# Altium project Artist_V1.PrjPcb
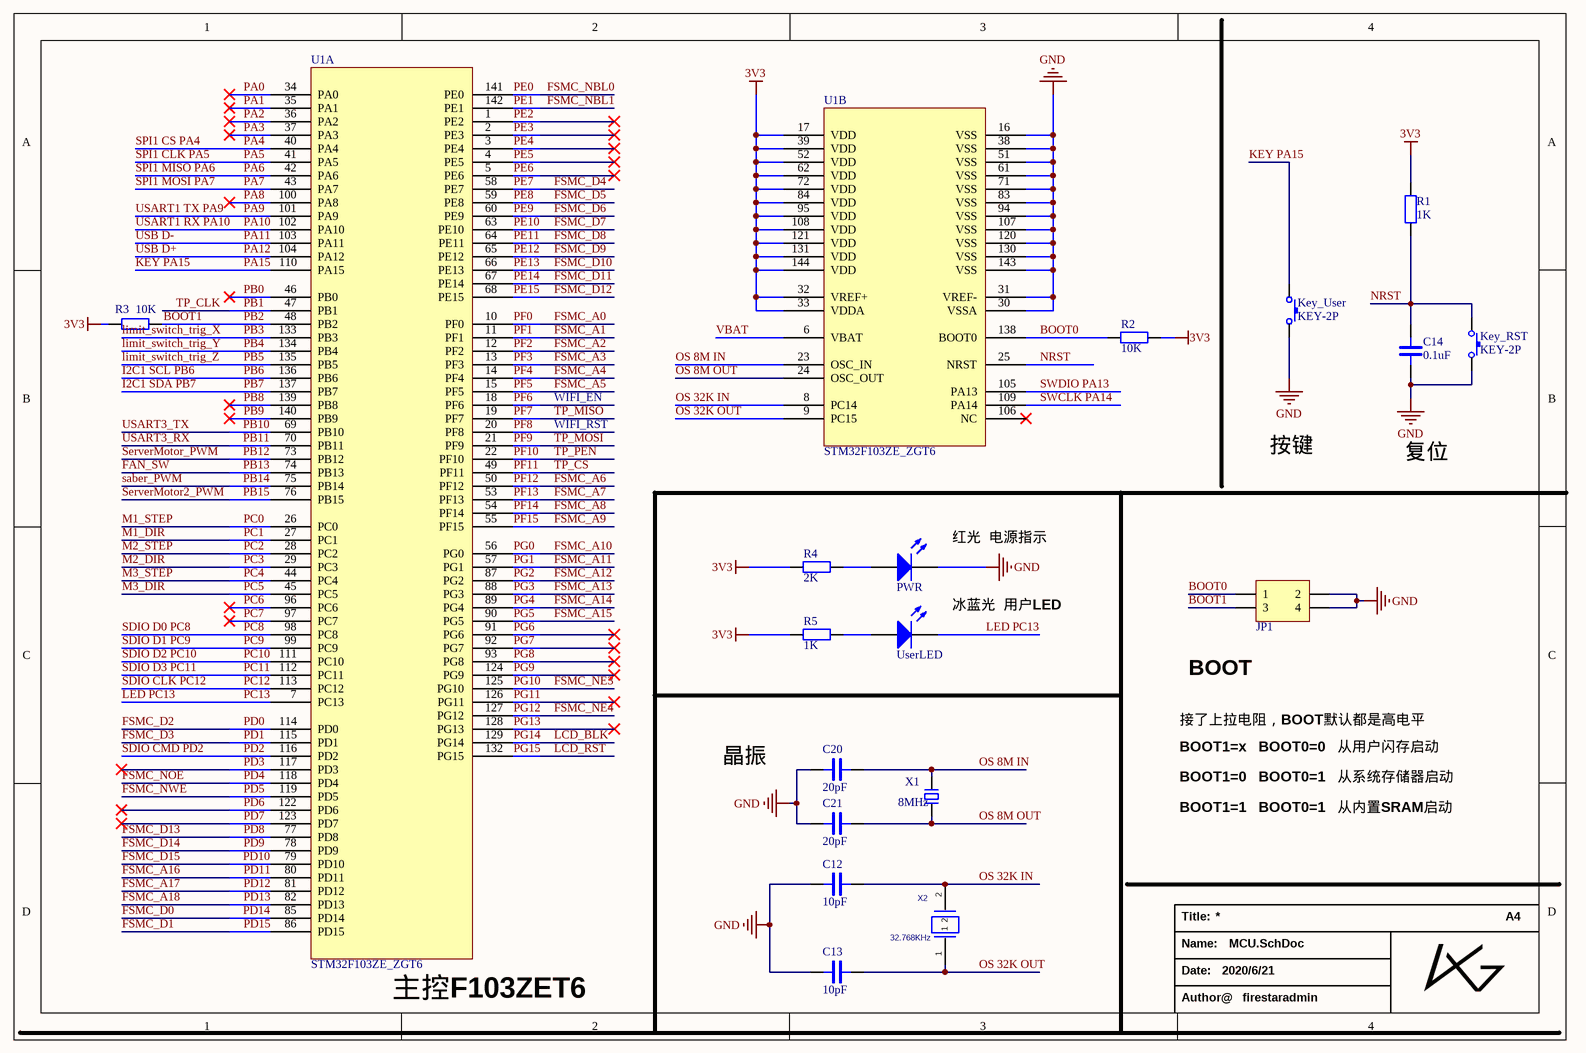
[diagram p0: MCU.SchDoc]
7 sheets, 125 parts. Net scope: global (net labels, ports and power ports of the same name join across sheets).
Board file: ArtistV1.0.PcbDoc
Sheets:
  MCU.SchDoc
  POWER.SchDoc
  Interface.SchDoc
  IC.SchDoc
  MOTORs.SchDoc
  screen.SchDoc
  ESP-12S.SchDoc

## Sheet MCU.SchDoc
size A4; Date: 2020/6/21

### Parts
C12  10pF  [C 0603_M]
C13  10pF  [C 0603_M]
C14  0.1uF  [C 0603_M]
C20  20pF  [C 0603_M]
C21  20pF  [C 0603_M]
JP1  Header2X2  [HDR2.54-LI-2x2P]  (value not drawn)
Key_RST  KEY-2P  [TSW SMD-3*6*2.5]
Key_User  KEY-2P  [TSW SMD-3*6*2.5]
PWR  LED  [LED 0603R]  (value not drawn)
R1  1K  [R 0603_M]
R2  10K  [R 0603_M]
R3  10K  [R 0603_M]
R4  2K  [R 0603_M]
R5  1K  [R 0603_M]
U1  STM32F103ZE_ZGT6  [TQFP144 20x20_M]  (parts A,B of 2)
UserLED  LED  [LED 0603B]  (value not drawn)
X1  8MHz  [OSC 5032-2P]
X2  value 32.768KHz  [OSC 3215-2P]  (hidden comment: XTAL_32.768KHZ_3215)

### Nets
3V3: R1.1 R2.2 R3.2 R4.2 R5.2 U1.17(VDD) U1.32(VREF+) U1.33(VDDA) U1.39(VDD) U1.52(VDD) U1.62(VDD) U1.72(VDD) U1.84(VDD) U1.95(VDD) U1.108(VDD) U1.121(VDD) U1.131(VDD) U1.144(VDD)
GND: C12.2 C13.2 C14.1 C20.2 C21.2 JP1.2 JP1.4 Key_RST.2 Key_User.2 PWR.2(K) U1.16(VSS) U1.30(VSSA) U1.31(VREF-) U1.38(VSS) U1.51(VSS) U1.61(VSS) U1.71(VSS) U1.83(VSS) U1.94(VSS) U1.107(VSS) U1.120(VSS) U1.130(VSS) U1.143(VSS)
BOOT0: JP1.1 R2.1 U1.138(BOOT0)
BOOT1: JP1.3 R3.1 U1.48(PB2)  [also labelled PB2]
FAN_SW: U1.74(PB13)  [also labelled PB13]
FSMC_A0: U1.10(PF0)  [also labelled PF0]
FSMC_A1: U1.11(PF1)  [also labelled PF1]
FSMC_A2: U1.12(PF2)  [also labelled PF2]
FSMC_A3: U1.13(PF3)  [also labelled PF3]
FSMC_A4: U1.14(PF4)  [also labelled PF4]
FSMC_A5: U1.15(PF5)  [also labelled PF5]
FSMC_A6: U1.50(PF12)  [also labelled PF12]
FSMC_A7: U1.53(PF13)  [also labelled PF13]
FSMC_A8: U1.54(PF14)  [also labelled PF14]
FSMC_A9: U1.55(PF15)  [also labelled PF15]
FSMC_A10: U1.56(PG0)  [also labelled PG0]
FSMC_A11: U1.57(PG1)  [also labelled PG1]
FSMC_A12: U1.87(PG2)  [also labelled PG2]
FSMC_A13: U1.88(PG3)  [also labelled PG3]
FSMC_A14: U1.89(PG4)  [also labelled PG4]
FSMC_A15: U1.90(PG5)  [also labelled PG5]
FSMC_A16: U1.80(PD11)  [also labelled PD11]
FSMC_A17: U1.81(PD12)  [also labelled PD12]
FSMC_A18: U1.82(PD13)  [also labelled PD13]
FSMC_D0: U1.85(PD14)  [also labelled PD14]
FSMC_D1: U1.86(PD15)  [also labelled PD15]
FSMC_D2: U1.114(PD0)  [also labelled PD0]
FSMC_D3: U1.115(PD1)  [also labelled PD1]
FSMC_D4: U1.58(PE7)  [also labelled PE7]
FSMC_D5: U1.59(PE8)  [also labelled PE8]
FSMC_D6: U1.60(PE9)  [also labelled PE9]
FSMC_D7: U1.63(PE10)  [also labelled PE10]
FSMC_D8: U1.64(PE11)  [also labelled PE11]
FSMC_D9: U1.65(PE12)  [also labelled PE12]
FSMC_D10: U1.66(PE13)  [also labelled PE13]
FSMC_D11: U1.67(PE14)  [also labelled PE14]
FSMC_D12: U1.68(PE15)  [also labelled PE15]
FSMC_D13: U1.77(PD8)  [also labelled PD8]
FSMC_D14: U1.78(PD9)  [also labelled PD9]
FSMC_D15: U1.79(PD10)  [also labelled PD10]
FSMC_NBL0: U1.141(PE0)  [also labelled PE0]
FSMC_NBL1: U1.142(PE1)  [also labelled PE1]
FSMC_NE3: U1.125(PG10)  [also labelled PG10]
FSMC_NE4: U1.127(PG12)  [also labelled PG12]
FSMC_NOE: U1.118(PD4)  [also labelled PD4]
FSMC_NWE: U1.119(PD5)  [also labelled PD5]
I2C1 SCL PB6: U1.136(PB6)  [also labelled PB6]
I2C1 SDA PB7: U1.137(PB7)  [also labelled PB7]
KEY PA15: Key_User.1 U1.110(PA15)  [also labelled PA15]
LCD_BLK: U1.129(PG14)  [also labelled PG14]
LCD_RST: U1.132(PG15)  [also labelled PG15]
LED PC13: U1.7(PC13) UserLED.2(K)  [also labelled PC13]
limit_switch_trig_X: U1.133(PB3)  [also labelled PB3]
limit_switch_trig_Y: U1.134(PB4)  [also labelled PB4]
limit_switch_trig_Z: U1.135(PB5)  [also labelled PB5]
M1_DIR: U1.27(PC1)  [also labelled PC1]
M1_STEP: U1.26(PC0)  [also labelled PC0]
M2_DIR: U1.29(PC3)  [also labelled PC3]
M2_STEP: U1.28(PC2)  [also labelled PC2]
M3_DIR: U1.45(PC5)  [also labelled PC5]
M3_STEP: U1.44(PC4)  [also labelled PC4]
NRST: C14.2 Key_RST.1 R1.2 U1.25(NRST)
OS 8M IN: C20.1 U1.23(OSC_IN) X1.1
OS 8M OUT: C21.1 U1.24(OSC_OUT) X1.2
OS 32K IN: C12.1 U1.8(PC14) X2.2
OS 32K OUT: C13.1 U1.9(PC15) X2.1
PA0: U1.34(PA0)
PA1: U1.35(PA1)
PA2: U1.36(PA2)
PA3: U1.37(PA3)
PA4: U1.40(PA4)  [also labelled SPI1 CS PA4]
PA5: U1.41(PA5)  [also labelled SPI1 CLK PA5]
PA6: U1.42(PA6)  [also labelled SPI1 MISO PA6]
PA7: U1.43(PA7)  [also labelled SPI1 MOSI PA7]
PA8: U1.100(PA8)
PA9: U1.101(PA9)  [also labelled USART1 TX PA9]
PA10: U1.102(PA10)  [also labelled USART1 RX PA10]
PA11: U1.103(PA11)  [also labelled USB D-]
PA12: U1.104(PA12)  [also labelled USB D+]
PB0: U1.46(PB0)
PB1: U1.47(PB1)  [also labelled TP_CLK]
PB8: U1.139(PB8)
PB9: U1.140(PB9)
PB10: U1.69(PB10)  [also labelled USART3_TX]
PB11: U1.70(PB11)  [also labelled USART3_RX]
PB12: U1.73(PB12)  [also labelled ServerMotor_PWM]
PB14: U1.75(PB14)  [also labelled saber_PWM]
PB15: U1.76(PB15)  [also labelled ServerMotor2_PWM]
PC6: U1.96(PC6)
PC7: U1.97(PC7)
PC8: U1.98(PC8)  [also labelled SDIO D0 PC8]
PC9: U1.99(PC9)  [also labelled SDIO D1 PC9]
PC10: U1.111(PC10)  [also labelled SDIO D2 PC10]
PC11: U1.112(PC11)  [also labelled SDIO D3 PC11]
PC12: U1.113(PC12)  [also labelled SDIO CLK PC12]
PD2: U1.116(PD2)  [also labelled SDIO CMD PD2]
PD3: U1.117(PD3)
PD6: U1.122(PD6)
PD7: U1.123(PD7)
PE2: U1.1(PE2)
PE3: U1.2(PE3)
PE4: U1.3(PE4)
PE5: U1.4(PE5)
PE6: U1.5(PE6)
PF6: U1.18(PF6)
PF7: U1.19(PF7)  [also labelled TP_MISO]
PF8: U1.20(PF8)
PF9: U1.21(PF9)  [also labelled TP_MOSI]
PF10: U1.22(PF10)  [also labelled TP_PEN]
PF11: U1.49(PF11)  [also labelled TP_CS]
PG6: U1.91(PG6)
PG7: U1.92(PG7)
PG8: U1.93(PG8)
PG9: U1.124(PG9)
PG11: U1.126(PG11)
PG13: U1.128(PG13)
SWCLK PA14: U1.109(PA14)
SWDIO PA13: U1.105(PA13)
VBAT: U1.6(VBAT)
NetPWR_1: PWR.1(A) R4.1
NetR5_1: R5.1 UserLED.1(A)

Not connected (* = marked no-connect by the designer): U1 106(NC)*

### Notes on the sheet
- WIFI_RST
- WIFI_EN
- 按键
- 复位
- (near PWR) 红光  电源指示
- 冰蓝光  用户LED
- 接了上拉电阻，BOOT默认都是高电平
- BOOT
- 晶振
- BOOT1=x   BOOT0=0   从用户闪存启动
- BOOT1=0   BOOT0=1   从系统存储器启动
- BOOT1=1   BOOT0=1   从内置SRAM启动
- (near U1) 主控F103ZET6
- Title:
- A4
- Name:
- Date:
- Author@
- firestaradmin

### Library data of the parts
C12-C14 C20 C21 = CAP: Capacitor
JP1 = Header 2X2: 2*2P接插件; 版权归属: 源创客; BOM名称: 2*2P接插件; 学习资源: www.ooocke.com
Key_RST Key_User = KEY-2P: Key
R1-R5 = RES: Resistor
X1 = XTAL-2P: 2脚无源脚晶振; 版权归属: 源创客; BOM名称: 2脚无源脚晶振; 学习资源: www.ooocke.com
X2 = XTAL_32.768KHZ_3215: CRYSTAL; PCB DECAL: 3215

## Sheet POWER.SchDoc
size A4
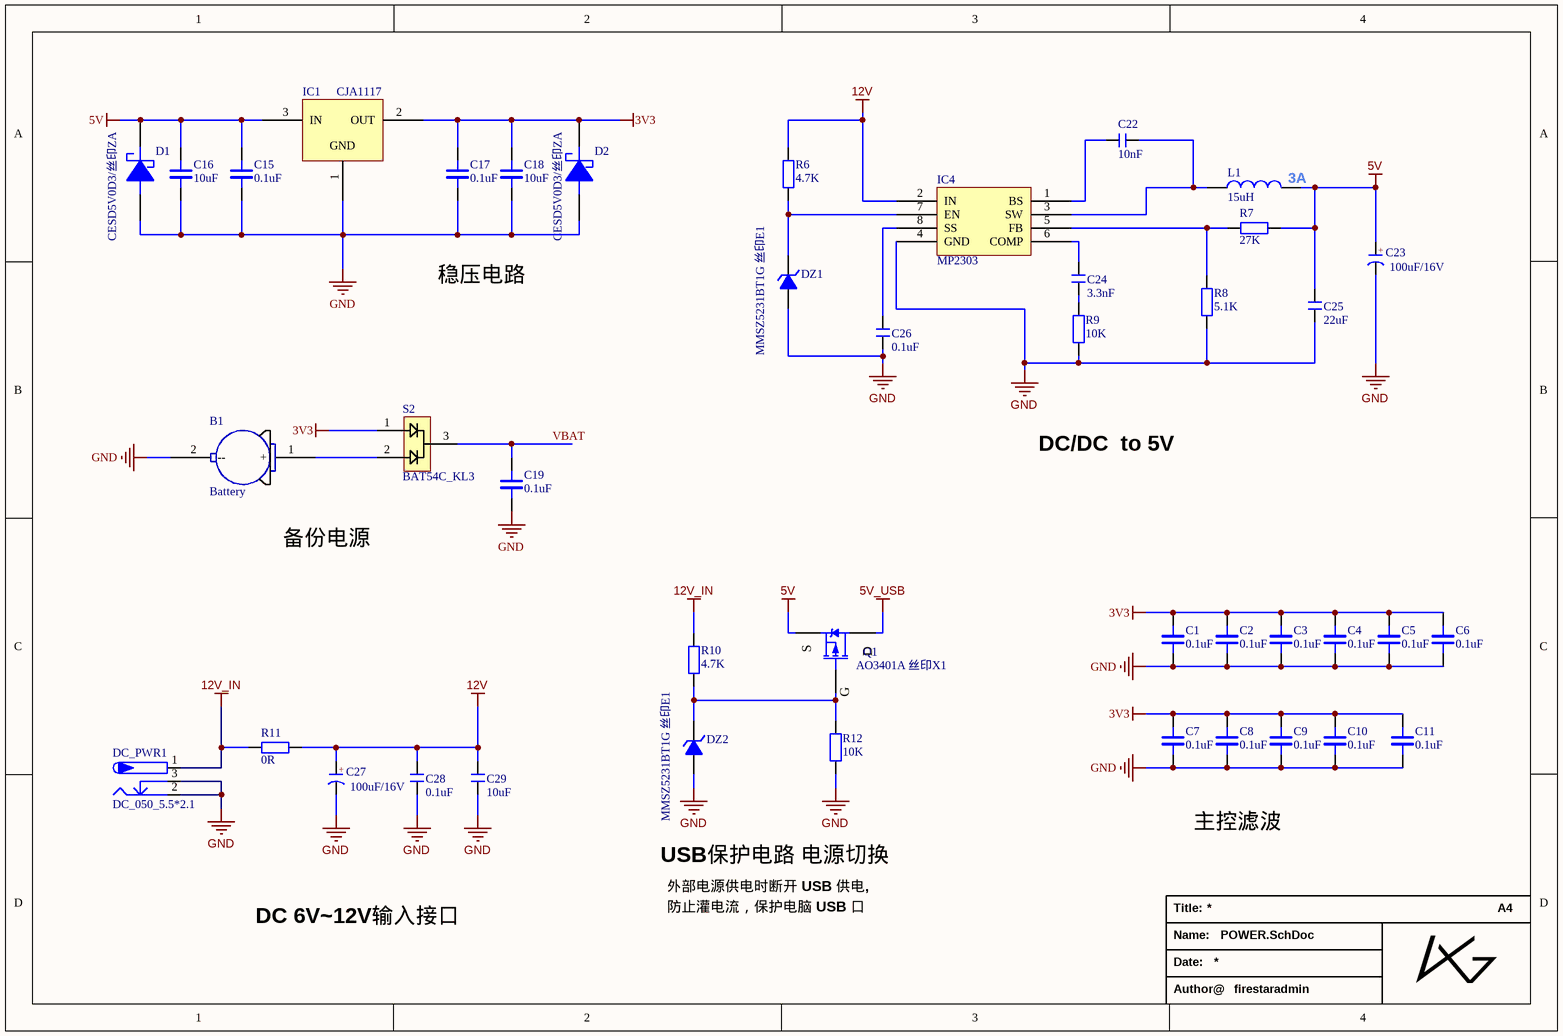
[diagram p1: POWER.SchDoc]

### Parts
B1  Battery  [CR1220_B]
C1  0.1uF  [C 0603_M]
C2  0.1uF  [C 0603_M]
C3  0.1uF  [C 0603_M]
C4  0.1uF  [C 0603_M]
C5  0.1uF  [C 0603_M]
C6  0.1uF  [C 0603_M]
C7  0.1uF  [C 0603_M]
C8  0.1uF  [C 0603_M]
C9  0.1uF  [C 0603_M]
C10  0.1uF  [C 0603_M]
C11  0.1uF  [C 0603_M]
C15  0.1uF  [C 0603_M]
C16  10uF  [C 0603_M]
C17  0.1uF  [C 0603_M]
C18  10uF  [C 0603_M]
C19  0.1uF  [C 0603_M]
C22  10nF  [C 0603_M]
C23  100uF/16V  [CM D(6.3*5.4)]
C24  3.3nF  [C 0603_M]
C25  22uF  [C 0603_M]
C26  0.1uF  [C 0603_M]
C27  100uF/16V  [CM D(6.3*5.4)]
C28  0.1uF  [C 0603_M]
C29  10uF  [C 0603_M]
D1  CESD5V0D3/丝印ZA  [SOD-323]
D2  CESD5V0D3/丝印ZA  [SOD-323]
DC_PWR1  DC_050_5.5*2.1  [DC-050]
DZ1  MMSZ5231BT1G 丝印E1  [SOD-123]
DZ2  MMSZ5231BT1G 丝印E1  [SOD-123]
IC1  CJA1117  [SOT89_M]
IC4  MP2303  [SOP8_M]
L1  15uH  [L-SMD-0630]
Q1  AO3401A 丝印X1  [SOT23-3M]
R6  4.7K  [R 0603_M]
R7  27K  [R 0603_M]
R8  5.1K  [R 0603_M]
R9  10K  [R 0603_M]
R10  4.7K  [R 0603_M]
R11  0R  [R 0603_M]
R12  10K  [R 0603_M]
S2  BAT54C_KL3  [SOT23-3M]

### Nets
3V3: C1.2 C2.2 C3.2 C4.2 C5.2 C6.2 C7.2 C8.2 C9.2 C10.2 C11.2 C17.1 C18.1 D2.2(-) IC1.2(OUT) S2.1
5V: C15.1 C16.1 C23.1(A) C25.2 D1.2(-) IC1.3(IN) L1.2 Q1.2(S) R7.1
5V_USB: Q1.3(D)
12V: C27.1(A) C28.2 C29.2 IC4.2(IN) R6.2 R11.2
12V_IN: DC_PWR1.1 R10.2 R11.1
GND: B1.2(--) C1.1 C2.1 C3.1 C4.1 C5.1 C6.1 C7.1 C8.1 C9.1 C10.1 C11.1 C15.2 C16.2 C17.2 C18.2 C19.2 C23.2(K) C25.1 C26.1 C27.2(K) C28.1 C29.1 D1.1(+) D2.1(+) DC_PWR1.2 DC_PWR1.3 DZ1.1(A) DZ2.1(A) IC1.1(GND) IC4.4(GND) R8.1 R9.1 R12.1
VBAT: C19.1 S2.3
NetB1_1: B1.1(+) S2.2
NetC22_1: C22.1 IC4.3(SW) L1.1
NetC22_2: C22.2 IC4.1(BS)
NetC24_1: C24.1 R9.2
NetC24_2: C24.2 IC4.6(COMP)
NetC26_2: C26.2 IC4.8(SS)
NetDZ1_2: DZ1.2(K) IC4.7(EN) R6.1
NetDZ2_2: DZ2.2(K) Q1.1(G) R10.1 R12.2
NetIC4_5: IC4.5(FB) R7.2 R8.2

### Notes on the sheet
- (near L1) 3A
- 稳压电路
- DC/DC  to 5V
- 备份电源
- 主控滤波
- DC 6V~12V输入接口
- USB保护电路 电源切换
- 外部电源供电时断开 USB 供电,
- 防止灌电流，保护电脑 USB 口
- Title:
- A4
- Name:
- Date:
- Author@
- firestaradmin
- (in symbol C-CM) +

### Library data of the parts
C1-C11 C15-C19 = CAP: Capacitor
C22 C24-C26 C28 C29 = C: 无极性贴片电容; 版权归属: 源创客; BOM名称: 无极性贴片电容; 学习资源: www.ooocke.com
C23 C27 = C-CM: 贴片电解电容; 版权归属: 源创客; BOM名称: 贴片电解电容; 学习资源: www.ooocke.com
D1 D2 = TVS
DC_PWR1 = P-DC: 低压电源接口; BOM名称: DC电源接口; 版权归属: 源创客; 学习资源: www.ooocke.com
DZ1 DZ2 = 1N4625: 5.1V/0.5W稳压管; 版权归属: 源创客; BOM名称: 5.1V/0.5W稳压管; 学习资源: www.ooocke.com
L1 = L: 小功率贴片电感; 版权归属: 源创客; BOM名称: 小功率贴片电感; 学习资源: www.ooocke.com
Q1 = SI2301: P沟道场效应管; 版权归属: 源创客; BOM名称: P沟道场效应管; 学习资源: www.ooocke.com
R6-R12 = R: 贴片电阻; 版权归属: 源创客; BOM名称: 贴片电阻; 学习资源: www.ooocke.com

## Sheet Interface.SchDoc
size A4
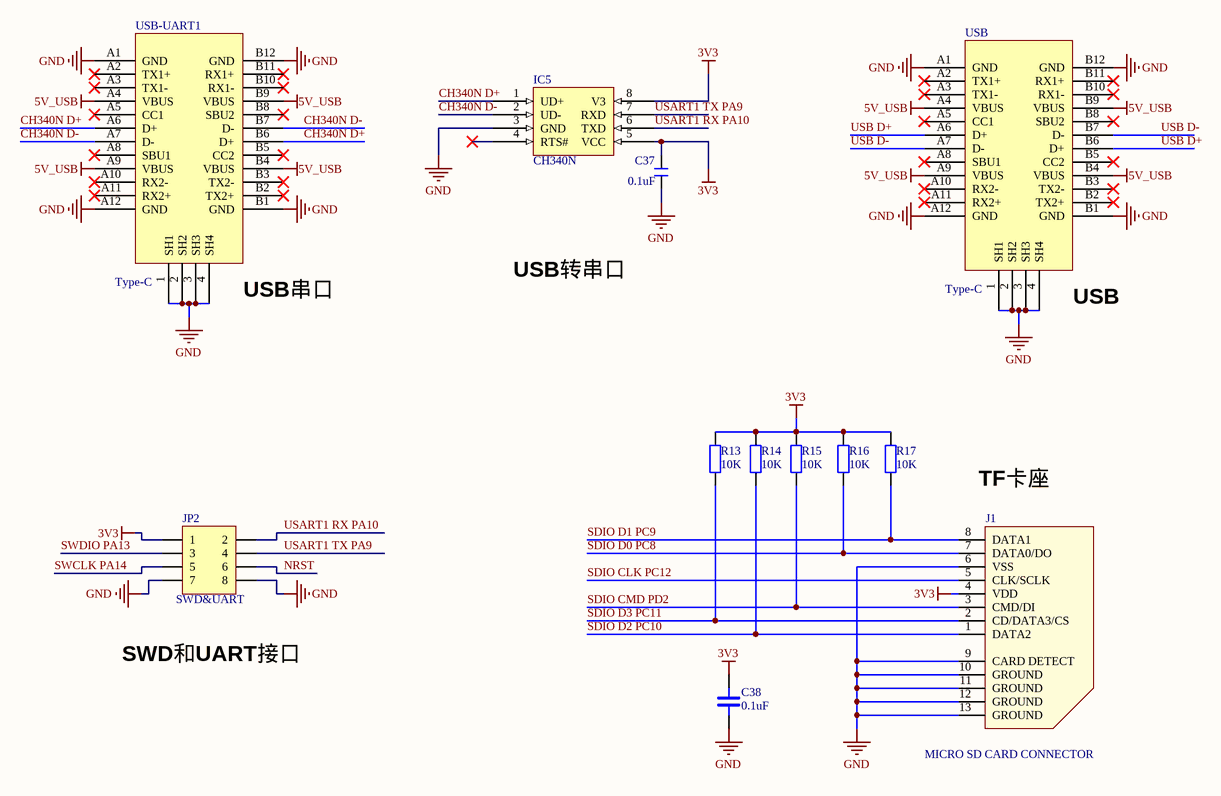
[diagram p2: Interface.SchDoc]

### Parts
C37  0.1uF  [C 0603_M]
C38  0.1uF  [C 0603_M]
IC5  CH340N  [SOP8_M]
J1  MICRO SD CARD CONNECTOR  [Micro SD]
JP2  SWD&UART  [HDR2.54-LI-2x4P]
R13  10K  [R 0603_M]
R14  10K  [R 0603_M]
R15  10K  [R 0603_M]
R16  10K  [R 0603_M]
R17  10K  [R 0603_M]
USB  Type-C  [Type-C]
USB-UART1  Type-C  [Type-C]

### Nets
3V3: C37.2 C38.1 IC5.5(VCC) IC5.8(V3) J1.4(VDD) JP2.1 R13.1 R14.1 R15.1 R16.1 R17.1
5V_USB: USB.A4(VBUS) USB.A9(VBUS) USB.B4(VBUS) USB.B9(VBUS) USB-UART1.A4(VBUS) USB-UART1.A9(VBUS) USB-UART1.B4(VBUS) USB-UART1.B9(VBUS)
GND: C37.1 C38.2 IC5.3(GND) J1.6(VSS) J1.9(CARD_DETECT) J1.10(GROUND) J1.11(GROUND) J1.12(GROUND) J1.13(GROUND) JP2.7 JP2.8 USB.1(SH1) USB.2(SH2) USB.3(SH3) USB.4(SH4) USB.A1(GND) USB.A12(GND) USB.B1(GND) USB.B12(GND) USB-UART1.1(SH1) USB-UART1.2(SH2) USB-UART1.3(SH3) USB-UART1.4(SH4) USB-UART1.A1(GND) USB-UART1.A12(GND) USB-UART1.B1(GND) USB-UART1.B12(GND)
CH340N D+: IC5.1(UD+) USB-UART1.A6(D+) USB-UART1.B6(D+)
CH340N D-: IC5.2(UD-) USB-UART1.A7(D-) USB-UART1.B7(D-)
NRST: JP2.6
SDIO CLK PC12: J1.5(CLK/SCLK)  [project net PC12]
SDIO CMD PD2: J1.3(CMD/DI) R15.2  [project net PD2]
SDIO D0 PC8: J1.7(DATA0/DO) R16.2  [project net PC8]
SDIO D1 PC9: J1.8(DATA1) R17.2  [project net PC9]
SDIO D2 PC10: J1.1(DATA2) R14.2  [project net PC10]
SDIO D3 PC11: J1.2(CD/DATA3/CS) R13.2  [project net PC11]
SWCLK PA14: JP2.5
SWDIO PA13: JP2.3
USART1 RX PA10: IC5.6(TXD) JP2.2  [project net PA10]
USART1 TX PA9: IC5.7(RXD) JP2.4  [project net PA9]
USB D+: USB.A6(D+) USB.B6(D+)  [project net PA12]
USB D-: USB.A7(D-) USB.B7(D-)  [project net PA11]

Not connected (* = marked no-connect by the designer): IC5 4(RTS#)*; USB A2(TX1+)* A3(TX1-)* A5(CC1)* A8(SBU1)* A10(RX2-)* A11(RX2+)* B2(TX2+)* B3(TX2-)* B5(CC2)* B8(SBU2)* B10(RX1-)* B11(RX1+)*; USB-UART1 A2(TX1+)* A3(TX1-)* A5(CC1)* A8(SBU1)* A10(RX2-)* A11(RX2+)* B2(TX2+)* B3(TX2-)* B5(CC2)* B8(SBU2)* B10(RX1-)* B11(RX1+)*

### Notes on the sheet
- (near USB-UART1) USB串口
- USB转串口
- (near USB) USB
- (near J1) TF卡座
- SWD和UART接口
- Title:
- A4
- Name:
- Date:
- Author@
- firestaradmin

### Library data of the parts
C37 = C: 无极性贴片电容; 版权归属: 源创客; BOM名称: 无极性贴片电容; 学习资源: www.ooocke.com
C38 = CAP: Capacitor
IC5 = CH340N: USB 转串口芯片 CH330/CH340N
JP2 = Header 4X2: 4*2P接插件; 版权归属: 源创客; BOM名称: 4*2P接插件; 学习资源: www.ooocke.com
R13-R17 = RES: Resistor

## Sheet IC.SchDoc
size A4
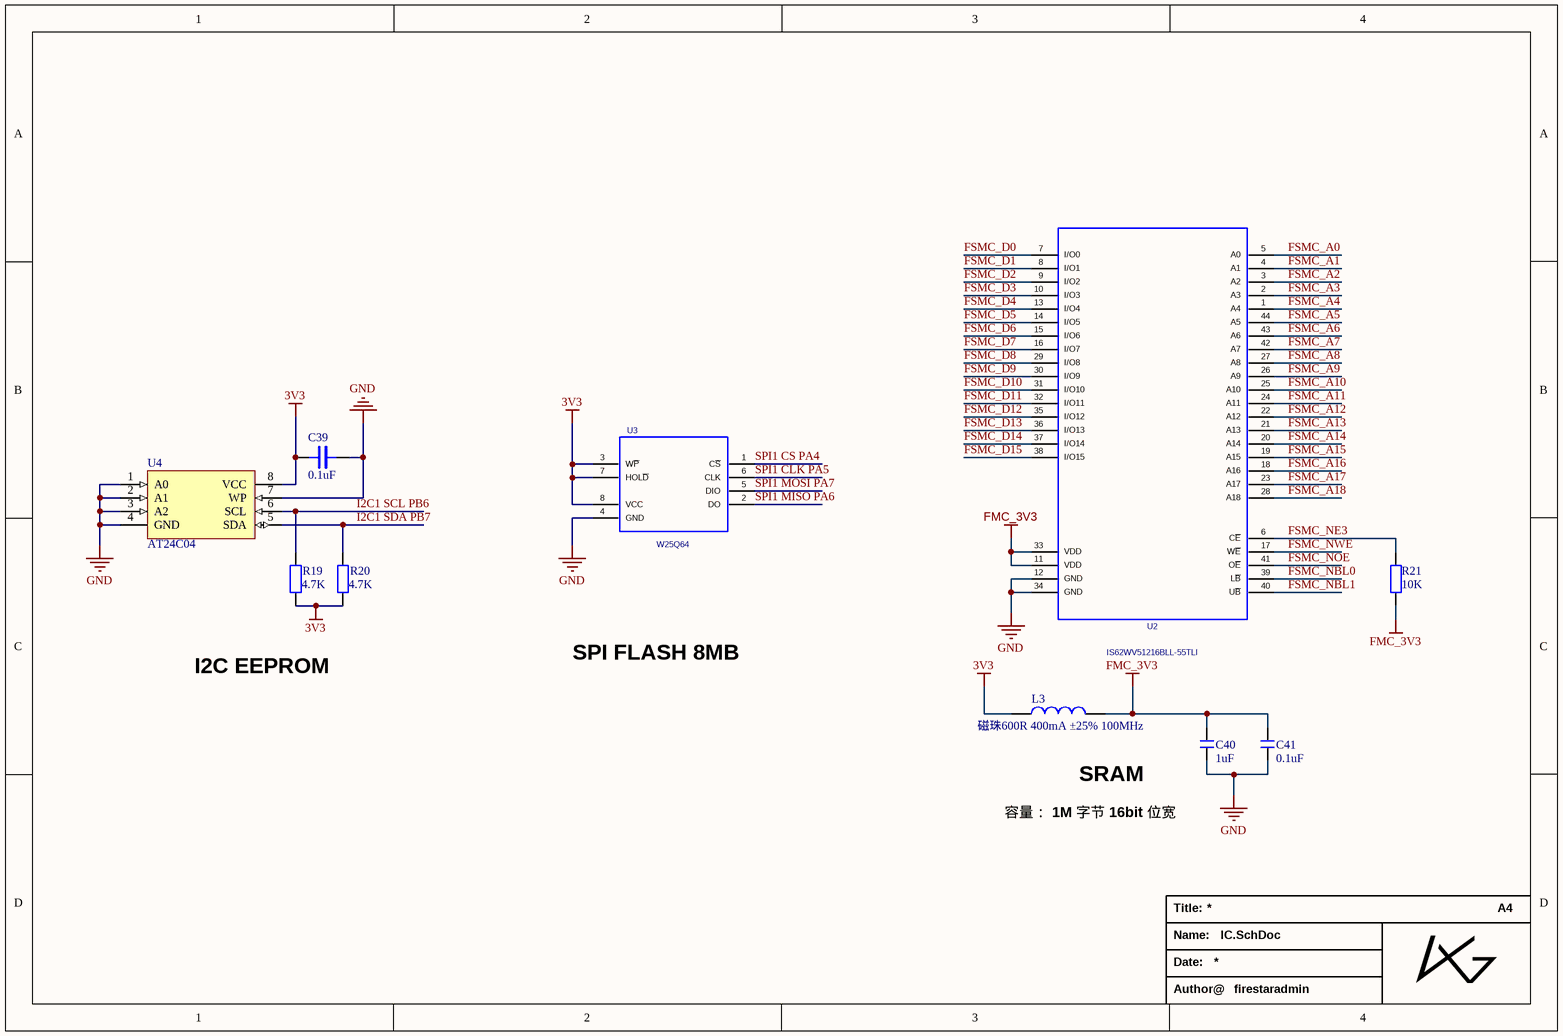
[diagram p3: IC.SchDoc]

### Parts
C39  0.1uF  [C 0603_M]
C40  1uF  [C 0603_M]
C41  0.1uF  [C 0603_M]
L3  磁珠600R 400mA ±25% 100MHz  [L 0603]
R19  4.7K  [R 0603_M]
R20  4.7K  [R 0603_M]
R21  10K  [R 0603_M]
U2  IS62WV51216BLL-55TLI  [TSOP44-0.8MM]
U3  W25Q64  [SOP8W_M]
U4  AT24C04  [SOP8_M]

### Nets
3V3: C39.1 L3.1 R19.2 R20.2 U3.3(W~{P}) U3.7(HOL~{D}) U3.8(VCC) U4.8(VCC)
FMC_3V3: C40.2 C41.2 L3.2 R21.2 U2.11(VDD) U2.33(VDD)
GND: C39.2 C40.1 C41.1 U2.12(GND) U2.34(GND) U3.4(GND) U4.1(A0) U4.2(A1) U4.3(A2) U4.4(GND) U4.7(WP)
FSMC_A0: U2.5(A0)
FSMC_A1: U2.4(A1)
FSMC_A2: U2.3(A2)
FSMC_A3: U2.2(A3)
FSMC_A4: U2.1(A4)
FSMC_A5: U2.44(A5)
FSMC_A6: U2.43(A6)
FSMC_A7: U2.42(A7)
FSMC_A8: U2.27(A8)
FSMC_A9: U2.26(A9)
FSMC_A10: U2.25(A10)
FSMC_A11: U2.24(A11)
FSMC_A12: U2.22(A12)
FSMC_A13: U2.21(A13)
FSMC_A14: U2.20(A14)
FSMC_A15: U2.19(A15)
FSMC_A16: U2.18(A16)
FSMC_A17: U2.23(A17)
FSMC_A18: U2.28(A18)
FSMC_D0: U2.7(I/O0)
FSMC_D1: U2.8(I/O1)
FSMC_D2: U2.9(I/O2)
FSMC_D3: U2.10(I/O3)
FSMC_D4: U2.13(I/O4)
FSMC_D5: U2.14(I/O5)
FSMC_D6: U2.15(I/O6)
FSMC_D7: U2.16(I/O7)
FSMC_D8: U2.29(I/O8)
FSMC_D9: U2.30(I/O9)
FSMC_D10: U2.31(I/O10)
FSMC_D11: U2.32(I/O11)
FSMC_D12: U2.35(I/O12)
FSMC_D13: U2.36(I/O13)
FSMC_D14: U2.37(I/O14)
FSMC_D15: U2.38(I/O15)
FSMC_NBL0: U2.39(L~{B})
FSMC_NBL1: U2.40(U~{B})
FSMC_NE3: R21.1 U2.6(C~{E})
FSMC_NOE: U2.41(O~{E})
FSMC_NWE: U2.17(W~{E})
I2C1 SCL PB6: R19.1 U4.6(SCL)
I2C1 SDA PB7: R20.1 U4.5(SDA)
SPI1 CLK PA5: U3.6(CLK)  [project net PA5]
SPI1 CS PA4: U3.1(C~{S})  [project net PA4]
SPI1 MISO PA6: U3.2(DO)  [project net PA6]
SPI1 MOSI PA7: U3.5(DIO)  [project net PA7]

### Notes on the sheet
- I2C EEPROM
- SPI FLASH 8MB
- (near L3) SRAM
- 容量： 1M 字节 16bit 位宽
- Title:
- A4
- Name:
- Date:
- Author@
- firestaradmin

### Library data of the parts
C39 = CAP: Capacitor
C40 C41 = C: 无极性贴片电容; 版权归属: 源创客; BOM名称: 无极性贴片电容; 学习资源: www.ooocke.com
L3 = L: 小功率贴片电感; 版权归属: 源创客; BOM名称: 小功率贴片电感; 学习资源: www.ooocke.com
R19-R21 = RES: Resistor
U2 = IS62WV51216BLL-55TLI: TSOP-II,2.5V - 3.6V, 512K x 16,55ns; Manufacturer #1 PN: IS62WV51216BLL-55TI; Manufacturer #1: ISSI; Value: IS62WV51216BLL-55TI; Tolerance: 55ns; PCB DECAL: TSOP44-0.8MM
U3 = W25Q64: PCB DECAL: SO8WB
U4 = AT24Cxx: EEPROM

## Sheet MOTORs.SchDoc
size A4
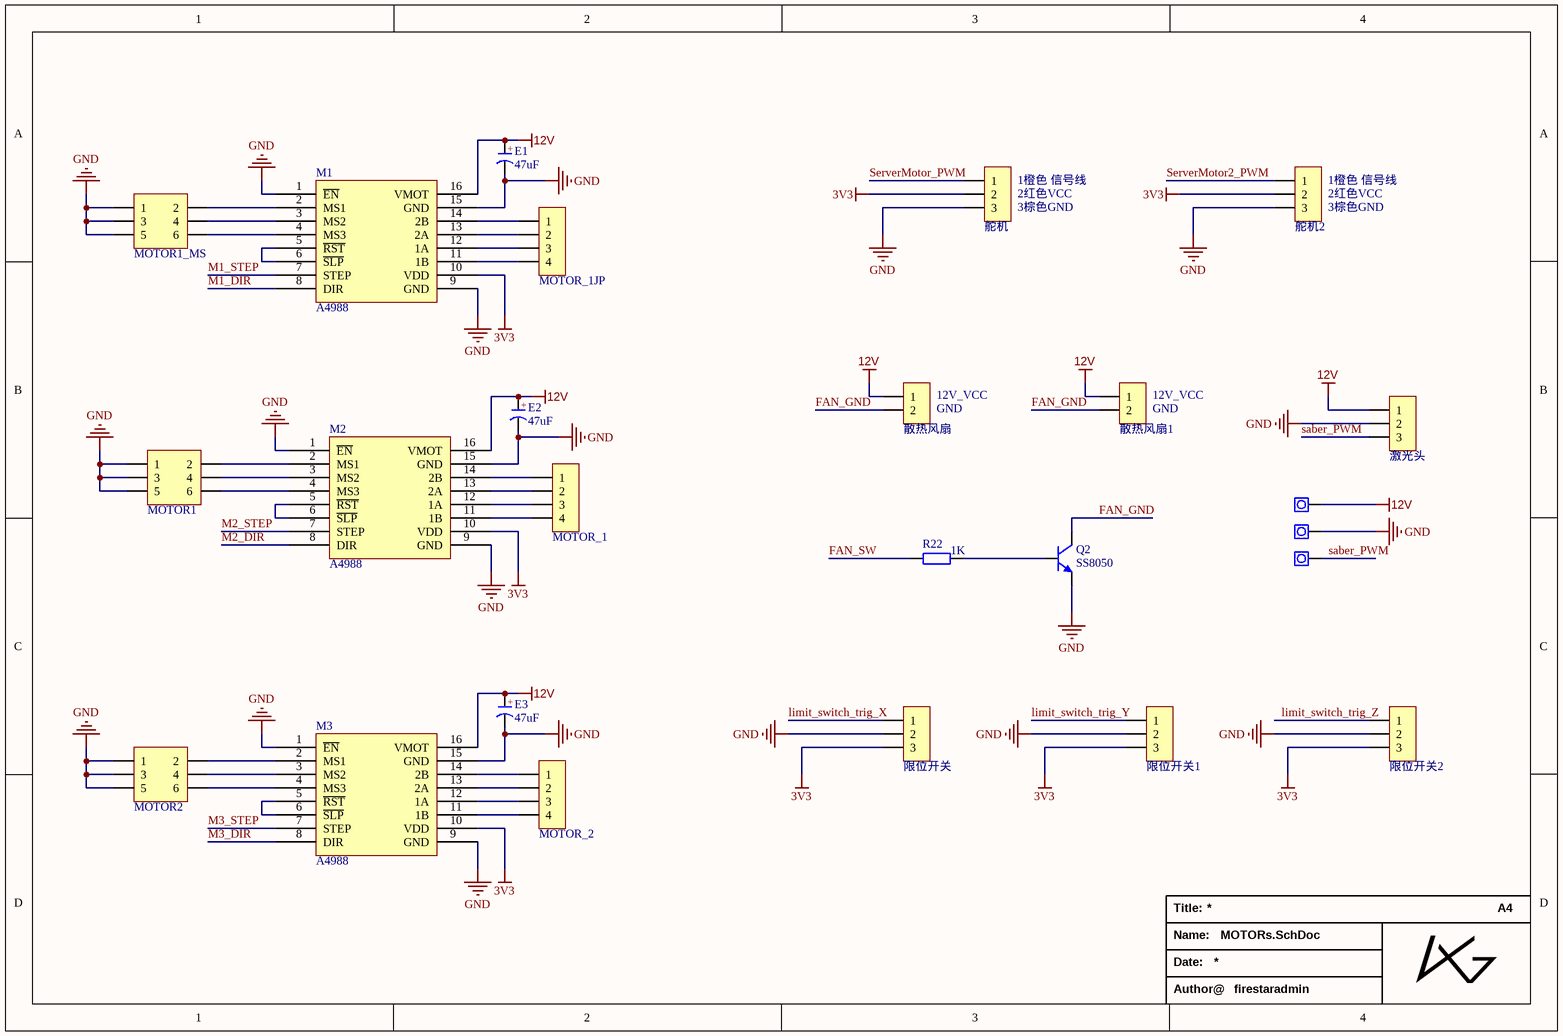
[diagram p4: MOTORs.SchDoc]

### Parts
E1  47uF  [CM D(6.3*5.4)]
E2  47uF  [CM D(6.3*5.4)]
E3  47uF  [CM D(6.3*5.4)]
M1  A4988  [DRV8825]
M2  A4988  [DRV8825]
M3  A4988  [DRV8825]
MOTOR1  Header3X2  [HDR2.54-LI-2x3P]  (value not drawn)
MOTOR1_MS  Header3X2  [HDR2.54-LI-2x3P]  (value not drawn)
MOTOR2  Header3X2  [HDR2.54-LI-2x3P]  (value not drawn)
MOTOR_1  HDR-1X4  [HDR2.54-LI-4P]  (value not drawn)
MOTOR_1JP  HDR-1X4  [HDR2.54-LI-4P]  (value not drawn)
MOTOR_2  HDR-1X4  [HDR2.54-LI-4P]  (value not drawn)
PAD  焊盘2mm*3mm  [PAD-2mm*3mm]  (value not drawn)
PAD1  焊盘2mm*3mm  [PAD-2mm*3mm]  (value not drawn)
PAD2  焊盘2mm*3mm  [PAD-2mm*3mm]  (value not drawn)
Q2  SS8050  [SOT23-3M]
R22  1K  [R 0603_M]
散热风扇  HDR-1X2  [XH2.54-LI-2P]  (value not drawn)
散热风扇1  HDR-1X2  [XH2.54-LI-2P]  (value not drawn)
激光头  HDR-1X3  [HDR2.54-LI-3P]  (value not drawn)
舵机  HDR-1X3  [HDR2.54-LI-3P]  (value not drawn)
舵机2  HDR-1X3  [HDR2.54-LI-3P]  (value not drawn)
限位开关  HDR-1X3  [HDR2.54-LI-3P]  (value not drawn)
限位开关1  HDR-1X3  [HDR2.54-LI-3P]  (value not drawn)
限位开关2  HDR-1X3  [HDR2.54-LI-3P]  (value not drawn)

### Nets
3V3: M1.10(VDD) M2.10(VDD) M3.10(VDD) 舵机.2 舵机2.2 限位开关.3 限位开关1.3 限位开关2.3
12V: E1.1(A) E2.1(A) E3.1(A) M1.16(VMOT) M2.16(VMOT) M3.16(VMOT) PAD.1 散热风扇.1 散热风扇1.1 激光头.1
GND: E1.2(K) E2.2(K) E3.2(K) M1.1(~{EN}) M1.9(GND) M1.15(GND) M2.1(~{EN}) M2.9(GND) M2.15(GND) M3.1(~{EN}) M3.9(GND) M3.15(GND) MOTOR1.1 MOTOR1.3 MOTOR1.5 MOTOR1_MS.1 MOTOR1_MS.3 MOTOR1_MS.5 MOTOR2.1 MOTOR2.3 MOTOR2.5 PAD1.1 Q2.2(E) 激光头.2 舵机.3 舵机2.3 限位开关.2 限位开关1.2 限位开关2.2
FAN_GND: Q2.3(C) 散热风扇.2 散热风扇1.2
FAN_SW: R22.1
limit_switch_trig_X: 限位开关.1
limit_switch_trig_Y: 限位开关1.1
limit_switch_trig_Z: 限位开关2.1
M1_DIR: M1.8(DIR)
M1_STEP: M1.7(STEP)
M2_DIR: M2.8(DIR)
M2_STEP: M2.7(STEP)
M3_DIR: M3.8(DIR)
M3_STEP: M3.7(STEP)
saber_PWM: PAD2.1 激光头.3  [project net PB14]
ServerMotor2_PWM: 舵机2.1  [project net PB15]
ServerMotor_PWM: 舵机.1  [project net PB12]
NetM1_2: M1.2(MS1) MOTOR1_MS.2
NetM1_3: M1.3(MS2) MOTOR1_MS.4
NetM1_4: M1.4(MS3) MOTOR1_MS.6
NetM1_5: M1.5(~{RST}) M1.6(~{SLP})
NetM1_11: M1.11(1B) MOTOR_1JP.4
NetM1_12: M1.12(1A) MOTOR_1JP.3
NetM1_13: M1.13(2A) MOTOR_1JP.2
NetM1_14: M1.14(2B) MOTOR_1JP.1
NetM2_2: M2.2(MS1) MOTOR1.2
NetM2_3: M2.3(MS2) MOTOR1.4
NetM2_4: M2.4(MS3) MOTOR1.6
NetM2_5: M2.5(~{RST}) M2.6(~{SLP})
NetM2_11: M2.11(1B) MOTOR_1.4
NetM2_12: M2.12(1A) MOTOR_1.3
NetM2_13: M2.13(2A) MOTOR_1.2
NetM2_14: M2.14(2B) MOTOR_1.1
NetM3_2: M3.2(MS1) MOTOR2.2
NetM3_3: M3.3(MS2) MOTOR2.4
NetM3_4: M3.4(MS3) MOTOR2.6
NetM3_5: M3.5(~{RST}) M3.6(~{SLP})
NetM3_11: M3.11(1B) MOTOR_2.4
NetM3_12: M3.12(1A) MOTOR_2.3
NetM3_13: M3.13(2A) MOTOR_2.2
NetM3_14: M3.14(2B) MOTOR_2.1
NetQ2_1: Q2.1(B) R22.2

### Notes on the sheet
- (near 舵机) 1橙色 信号线
- (near 舵机) 2红色VCC
- (near 舵机) 3棕色GND
- (near 舵机2) 1橙色 信号线
- (near 舵机2) 2红色VCC
- (near 舵机2) 3棕色GND
- (near 散热风扇) 12V_VCC
- (near 散热风扇) GND
- (near 散热风扇1) 12V_VCC
- (near 散热风扇1) GND
- Title:
- A4
- Name:
- Date:
- Author@
- firestaradmin
- (in symbol C-CM) +

### Library data of the parts
E1-E3 = C-CM: 贴片电解电容; 版权归属: 源创客; BOM名称: 贴片电解电容; 学习资源: www.ooocke.com
M1-M3 = A4988_MODEL: A4988 步进电机驱动
MOTOR1 MOTOR1_MS MOTOR2 = Header 3X2: 3*2P接插件; 版权归属: 源创客; BOM名称: 3*2P接插件; 学习资源: www.ooocke.com
MOTOR_1 MOTOR_1JP MOTOR_2 = Header 4: 4P接插件; 版权归属: 源创客; BOM名称: 4P接插件; 学习资源: www.ooocke.com
PAD PAD1 PAD2 = 焊盘2mm*3mm: 一般来接电源线之类的焊盘
Q2 = 8050-SMD: 高频放大-NPN型; 版权归属: 源创客; 属性: 40V 1.5A 1W 100MHZ; BOM名称: 高频放大-NPN型; 学习资源: www.ooocke.com
R22 = R: 贴片电阻; 版权归属: 源创客; BOM名称: 贴片电阻; 学习资源: www.ooocke.com
散热风扇 散热风扇1 = Header 2: 2P接插件; 版权归属: 源创客; BOM名称: 2P接插件; 学习资源: www.ooocke.com
激光头 舵机 舵机2 限位开关 限位开关1 限位开关2 = Header 3: 3P接插件; 版权归属: 源创客; BOM名称: 3P接插件; 学习资源: www.ooocke.com

## Sheet screen.SchDoc
size A4
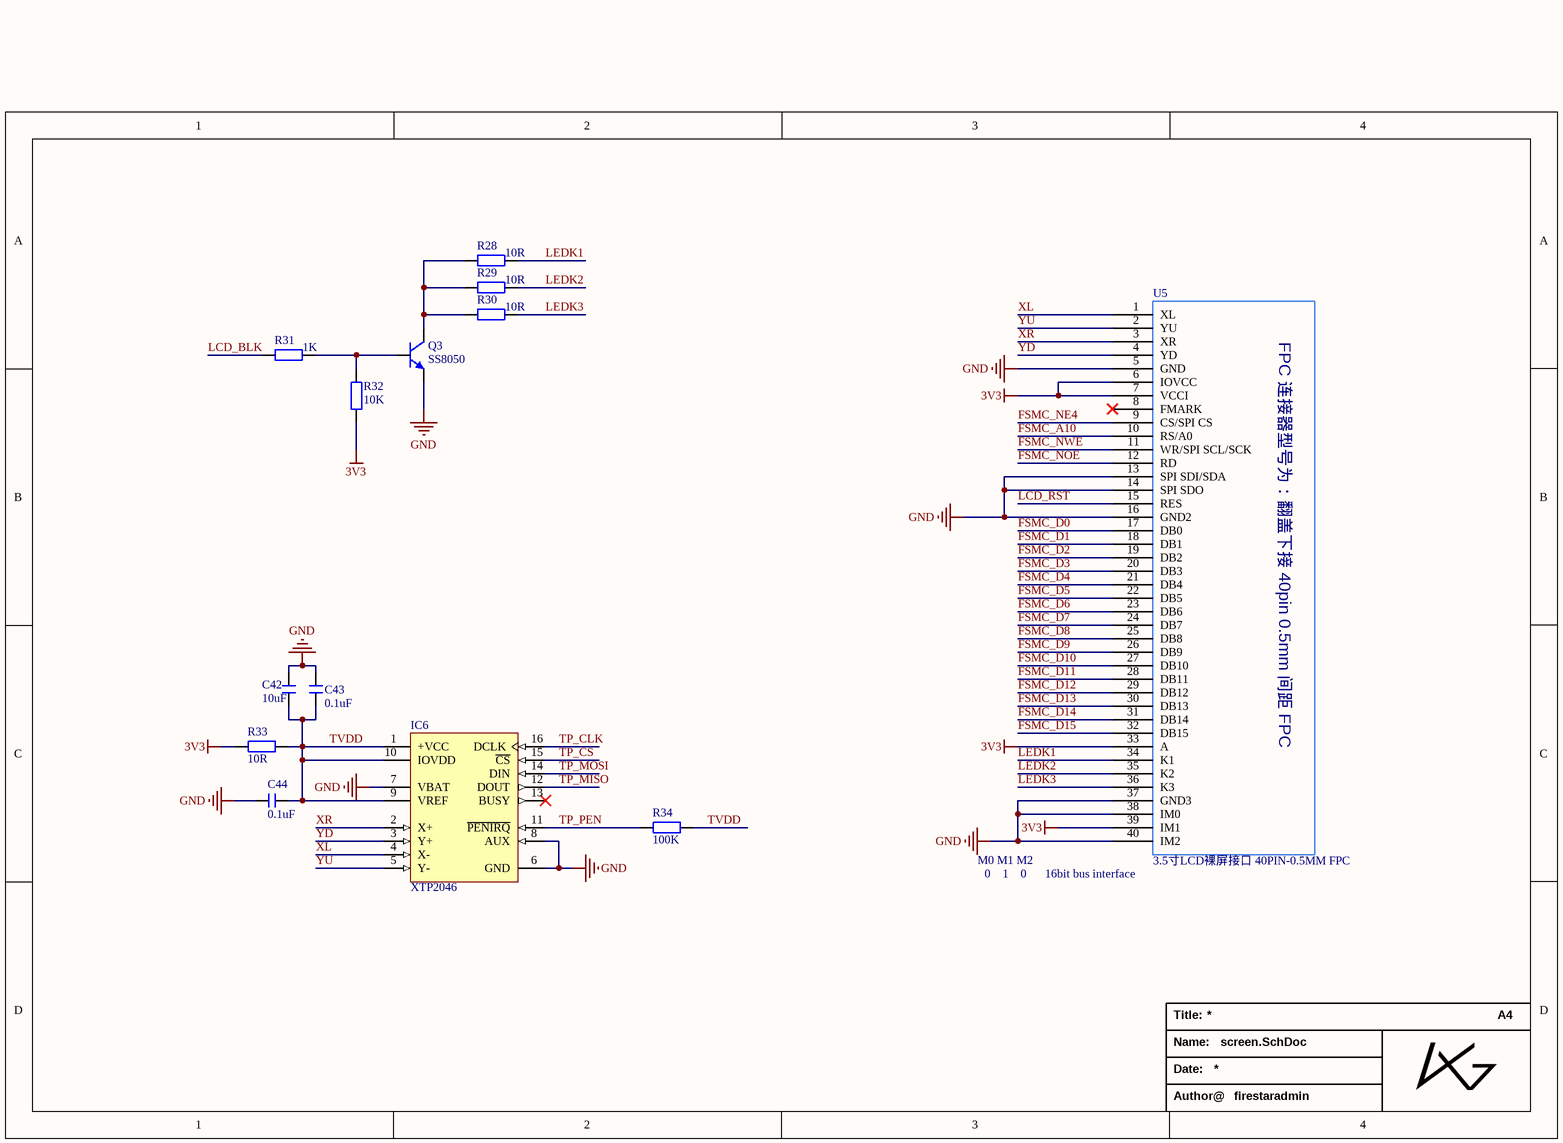
[diagram p5: screen.SchDoc]

### Parts
C42  10uF  [C 0603_M]
C43  0.1uF  [C 0603_M]
C44  0.1uF  [C 0603_M]
IC6  XTP2046  [TSSOP16_M]
Q3  SS8050  [SOT23-3M]
R28  10R  [R 0603_M]
R29  10R  [R 0603_M]
R30  10R  [R 0603_M]
R31  1K  [R 0603_M]
R32  10K  [R 0603_M]
R33  10R  [R 0603_M]
R34  100K  [R 0603_M]
U5  3.5寸LCD裸屏接口 40PIN-0.5MM FPC  [FPC0.5 2H-WS-40P]

### Nets
3V3: R32.1 R33.1 U5.6(IOVCC) U5.7(VCCI) U5.33(A) U5.39(IM1)
GND: C42.1 C43.1 C44.2 IC6.6(GND) IC6.7(VBAT) IC6.8(AUX) Q3.2(E) U5.5(GND) U5.13(SPI_SDI/SDA) U5.14(SPI_SDO) U5.16(GND2) U5.37(GND3) U5.38(IM0) U5.40(IM2)
FSMC_A10: U5.10(RS/A0)
FSMC_D0: U5.17(DB0)
FSMC_D1: U5.18(DB1)
FSMC_D2: U5.19(DB2)
FSMC_D3: U5.20(DB3)
FSMC_D4: U5.21(DB4)
FSMC_D5: U5.22(DB5)
FSMC_D6: U5.23(DB6)
FSMC_D7: U5.24(DB7)
FSMC_D8: U5.25(DB8)
FSMC_D9: U5.26(DB9)
FSMC_D10: U5.27(DB10)
FSMC_D11: U5.28(DB11)
FSMC_D12: U5.29(DB12)
FSMC_D13: U5.30(DB13)
FSMC_D14: U5.31(DB14)
FSMC_D15: U5.32(DB15)
FSMC_NE4: U5.9(CS/SPI_CS)
FSMC_NOE: U5.12(RD)
FSMC_NWE: U5.11(WR/SPI_SCL/SCK)
LCD_BLK: R31.1
LCD_RST: U5.15(RES)
LEDK1: R28.2 U5.34(K1)
LEDK2: R29.2 U5.35(K2)
LEDK3: R30.2 U5.36(K3)
TP_CLK: IC6.16(DCLK)  [project net PB1]
TP_CS: IC6.15(~{CS})  [project net PF11]
TP_MISO: IC6.12(DOUT)  [project net PF7]
TP_MOSI: IC6.14(DIN)  [project net PF9]
TP_PEN: IC6.11(~{PENIRQ}) R34.1  [project net PF10]
TVDD: C42.2 C43.2 C44.1 IC6.1(+VCC) IC6.9(VREF) IC6.10(IOVDD) R33.2 R34.2
XL: IC6.4(X-) U5.1(XL)
XR: IC6.2(X+) U5.3(XR)
YD: IC6.3(Y+) U5.4(YD)
YU: IC6.5(Y-) U5.2(YU)
NetQ3_1: Q3.1(B) R31.2 R32.2
NetQ3_3: Q3.3(C) R28.1 R29.1 R30.1

Not connected (* = marked no-connect by the designer): IC6 13(BUSY)*; U5 8(FMARK)*

### Notes on the sheet
- M0 M1 M2
- 0    1    0
- (near U5) 16bit bus interface
- Title:
- A4
- Name:
- Date:
- Author@
- firestaradmin
- (in symbol 3.5寸LCD裸屏接口 40PIN-0.5MM FPC) FPC 连接器型号为：翻盖下接 40pin 0.5mm 间距 FPC

### Library data of the parts
C42-C44 = C: 无极性贴片电容; 版权归属: 源创客; BOM名称: 无极性贴片电容; 学习资源: www.ooocke.com
IC6 = TSC2046IPW: 显示屏触摸驱动芯片; BOM名称: 触摸驱动芯片; 版权归属: 源创客; 学习资源: www.ooocke.com
Q3 = 8050-SMD: as Q2 on sheet MOTORs; BOM名称: 高频放大-NPN型; 学习资源: www.ooocke.com
R28-R34 = R: 贴片电阻; 版权归属: 源创客; BOM名称: 贴片电阻; 学习资源: www.ooocke.com
U5 = 3.5寸LCD裸屏接口 40PIN-0.5MM FPC: 3.5寸LCD屏幕 40PIN-0.5MM FPC 接口

## Sheet ESP-12S.SchDoc
size A4
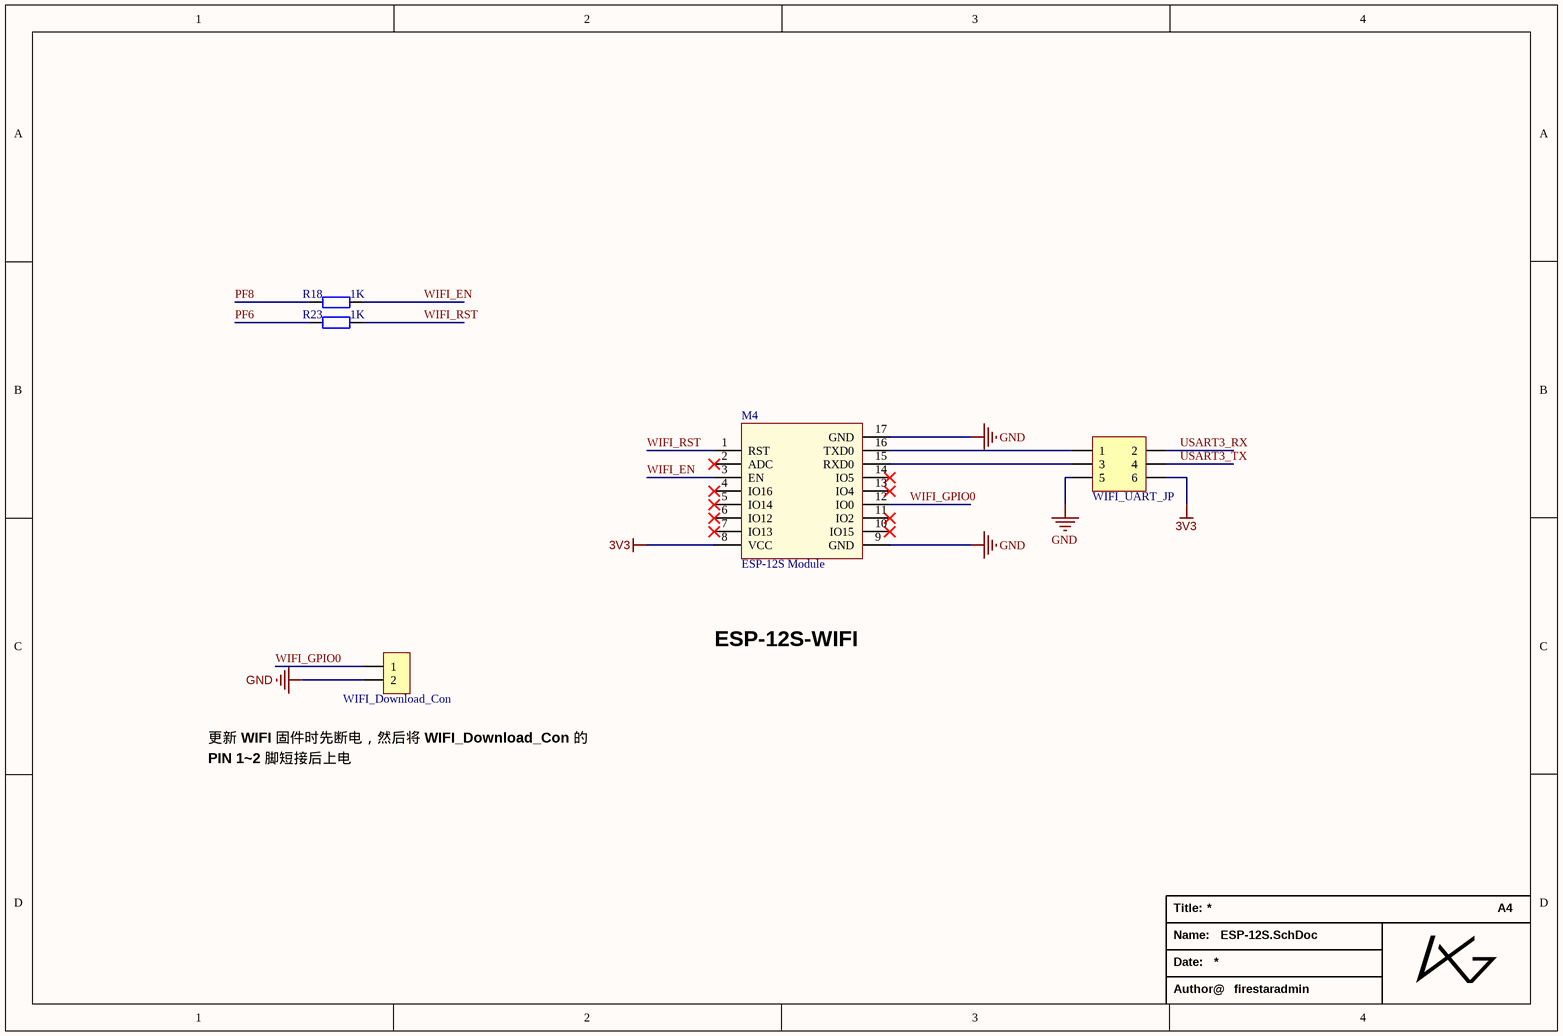
[diagram p6: ESP-12S.SchDoc]

### Parts
M4  ESP-12S Module  [ESP-12S Module]
R18  1K  [R 0603_M]
R23  1K  [R 0603_M]
WIFI_Download_Con  HDR-1X2  [HDR2.54-LI-2P]  (value not drawn)
WIFI_UART_JP  Header3X2  [HDR2.54-LI-2x3P]  (value not drawn)

### Nets
3V3: M4.8(VCC) WIFI_UART_JP.6
GND: M4.9(GND) M4.17(GND) WIFI_Download_Con.2 WIFI_UART_JP.5
PF6: R23.2
PF8: R18.2
USART3_RX: WIFI_UART_JP.2  [project net PB11]
USART3_TX: WIFI_UART_JP.4  [project net PB10]
WIFI_EN: M4.3(EN) R18.1
WIFI_GPIO0: M4.12(IO0) WIFI_Download_Con.1
WIFI_RST: M4.1(RST) R23.1
NetM4_15: M4.15(RXD0) WIFI_UART_JP.3
NetM4_16: M4.16(TXD0) WIFI_UART_JP.1

Not connected (* = marked no-connect by the designer): M4 2(ADC)* 4(IO16)* 5(IO14)* 6(IO12)* 7(IO13)* 10(IO15)* 11(IO2)* 13(IO4)* 14(IO5)*

### Notes on the sheet
- ESP-12S-WIFI
- (near WIFI_Download_Con) 更新 WIFI 固件时先断电，然后将 WIFI_Download_Con 的
- PIN 1~2 脚短接后上电
- Title:
- A4
- Name:
- Date:
- Author@
- firestaradmin

### Library data of the parts
R18 R23 = RES: Resistor
WIFI_Download_Con = Header 2: 2P接插件; 版权归属: 源创客; BOM名称: 2P接插件; 学习资源: www.ooocke.com
WIFI_UART_JP = Header 3X2: 3*2P接插件; 版权归属: 源创客; BOM名称: 3*2P接插件; 学习资源: www.ooocke.com

## Nets that join several sheets
3V3: MCU (18 pins), POWER (16 pins), Interface (11 pins), IC (8 pins), MOTORs (8 pins), screen (6 pins), ESP-12S (M4.8 WIFI_UART_JP.6)
5V_USB: POWER (Q1.3), Interface (8 pins)
12V: POWER (6 pins), MOTORs (10 pins)
GND: MCU (23 pins), POWER (34 pins), Interface (27 pins), IC (11 pins), MOTORs (29 pins), screen (14 pins), ESP-12S (M4.9 M4.17 WIFI_Download_Con.2 WIFI_UART_JP.5)
FAN_SW: MCU (U1.74), MOTORs (R22.1)
FSMC_A0: MCU (U1.10), IC (U2.5)
FSMC_A1: MCU (U1.11), IC (U2.4)
FSMC_A2: MCU (U1.12), IC (U2.3)
FSMC_A3: MCU (U1.13), IC (U2.2)
FSMC_A4: MCU (U1.14), IC (U2.1)
FSMC_A5: MCU (U1.15), IC (U2.44)
FSMC_A6: MCU (U1.50), IC (U2.43)
FSMC_A7: MCU (U1.53), IC (U2.42)
FSMC_A8: MCU (U1.54), IC (U2.27)
FSMC_A9: MCU (U1.55), IC (U2.26)
FSMC_A10: MCU (U1.56), IC (U2.25), screen (U5.10)
FSMC_A11: MCU (U1.57), IC (U2.24)
FSMC_A12: MCU (U1.87), IC (U2.22)
FSMC_A13: MCU (U1.88), IC (U2.21)
FSMC_A14: MCU (U1.89), IC (U2.20)
FSMC_A15: MCU (U1.90), IC (U2.19)
FSMC_A16: MCU (U1.80), IC (U2.18)
FSMC_A17: MCU (U1.81), IC (U2.23)
FSMC_A18: MCU (U1.82), IC (U2.28)
FSMC_D0: MCU (U1.85), IC (U2.7), screen (U5.17)
FSMC_D1: MCU (U1.86), IC (U2.8), screen (U5.18)
FSMC_D2: MCU (U1.114), IC (U2.9), screen (U5.19)
FSMC_D3: MCU (U1.115), IC (U2.10), screen (U5.20)
FSMC_D4: MCU (U1.58), IC (U2.13), screen (U5.21)
FSMC_D5: MCU (U1.59), IC (U2.14), screen (U5.22)
FSMC_D6: MCU (U1.60), IC (U2.15), screen (U5.23)
FSMC_D7: MCU (U1.63), IC (U2.16), screen (U5.24)
FSMC_D8: MCU (U1.64), IC (U2.29), screen (U5.25)
FSMC_D9: MCU (U1.65), IC (U2.30), screen (U5.26)
FSMC_D10: MCU (U1.66), IC (U2.31), screen (U5.27)
FSMC_D11: MCU (U1.67), IC (U2.32), screen (U5.28)
FSMC_D12: MCU (U1.68), IC (U2.35), screen (U5.29)
FSMC_D13: MCU (U1.77), IC (U2.36), screen (U5.30)
FSMC_D14: MCU (U1.78), IC (U2.37), screen (U5.31)
FSMC_D15: MCU (U1.79), IC (U2.38), screen (U5.32)
FSMC_NBL0: MCU (U1.141), IC (U2.39)
FSMC_NBL1: MCU (U1.142), IC (U2.40)
FSMC_NE3: MCU (U1.125), IC (R21.1 U2.6)
FSMC_NE4: MCU (U1.127), screen (U5.9)
FSMC_NOE: MCU (U1.118), IC (U2.41), screen (U5.12)
FSMC_NWE: MCU (U1.119), IC (U2.17), screen (U5.11)
I2C1 SCL PB6: MCU (U1.136), IC (R19.1 U4.6)
I2C1 SDA PB7: MCU (U1.137), IC (R20.1 U4.5)
LCD_BLK: MCU (U1.129), screen (R31.1)
LCD_RST: MCU (U1.132), screen (U5.15)
limit_switch_trig_X: MCU (U1.133), MOTORs (限位开关.1)
limit_switch_trig_Y: MCU (U1.134), MOTORs (限位开关1.1)
limit_switch_trig_Z: MCU (U1.135), MOTORs (限位开关2.1)
M1_DIR: MCU (U1.27), MOTORs (M1.8)
M1_STEP: MCU (U1.26), MOTORs (M1.7)
M2_DIR: MCU (U1.29), MOTORs (M2.8)
M2_STEP: MCU (U1.28), MOTORs (M2.7)
M3_DIR: MCU (U1.45), MOTORs (M3.8)
M3_STEP: MCU (U1.44), MOTORs (M3.7)
NRST: MCU (C14.2 Key_RST.1 R1.2 U1.25), Interface (JP2.6)
PA4: MCU (U1.40), IC (U3.1)
PA5: MCU (U1.41), IC (U3.6)
PA6: MCU (U1.42), IC (U3.2)
PA7: MCU (U1.43), IC (U3.5)
PA9: MCU (U1.101), Interface (IC5.7 JP2.4)
PA10: MCU (U1.102), Interface (IC5.6 JP2.2)
PA11: MCU (U1.103), Interface (USB.A7 USB.B7)
PA12: MCU (U1.104), Interface (USB.A6 USB.B6)
PB1: MCU (U1.47), screen (IC6.16)
PB10: MCU (U1.69), ESP-12S (WIFI_UART_JP.4)
PB11: MCU (U1.70), ESP-12S (WIFI_UART_JP.2)
PB12: MCU (U1.73), MOTORs (舵机.1)
PB14: MCU (U1.75), MOTORs (PAD2.1 激光头.3)
PB15: MCU (U1.76), MOTORs (舵机2.1)
PC8: MCU (U1.98), Interface (J1.7 R16.2)
PC9: MCU (U1.99), Interface (J1.8 R17.2)
PC10: MCU (U1.111), Interface (J1.1 R14.2)
PC11: MCU (U1.112), Interface (J1.2 R13.2)
PC12: MCU (U1.113), Interface (J1.5)
PD2: MCU (U1.116), Interface (J1.3 R15.2)
PF6: MCU (U1.18), ESP-12S (R23.2)
PF7: MCU (U1.19), screen (IC6.12)
PF8: MCU (U1.20), ESP-12S (R18.2)
PF9: MCU (U1.21), screen (IC6.14)
PF10: MCU (U1.22), screen (IC6.11 R34.1)
PF11: MCU (U1.49), screen (IC6.15)
SWCLK PA14: MCU (U1.109), Interface (JP2.5)
SWDIO PA13: MCU (U1.105), Interface (JP2.3)
VBAT: MCU (U1.6), POWER (C19.1 S2.3)